# EAGLE design LPC_AP2_3.43 (EAGLE 5.00)
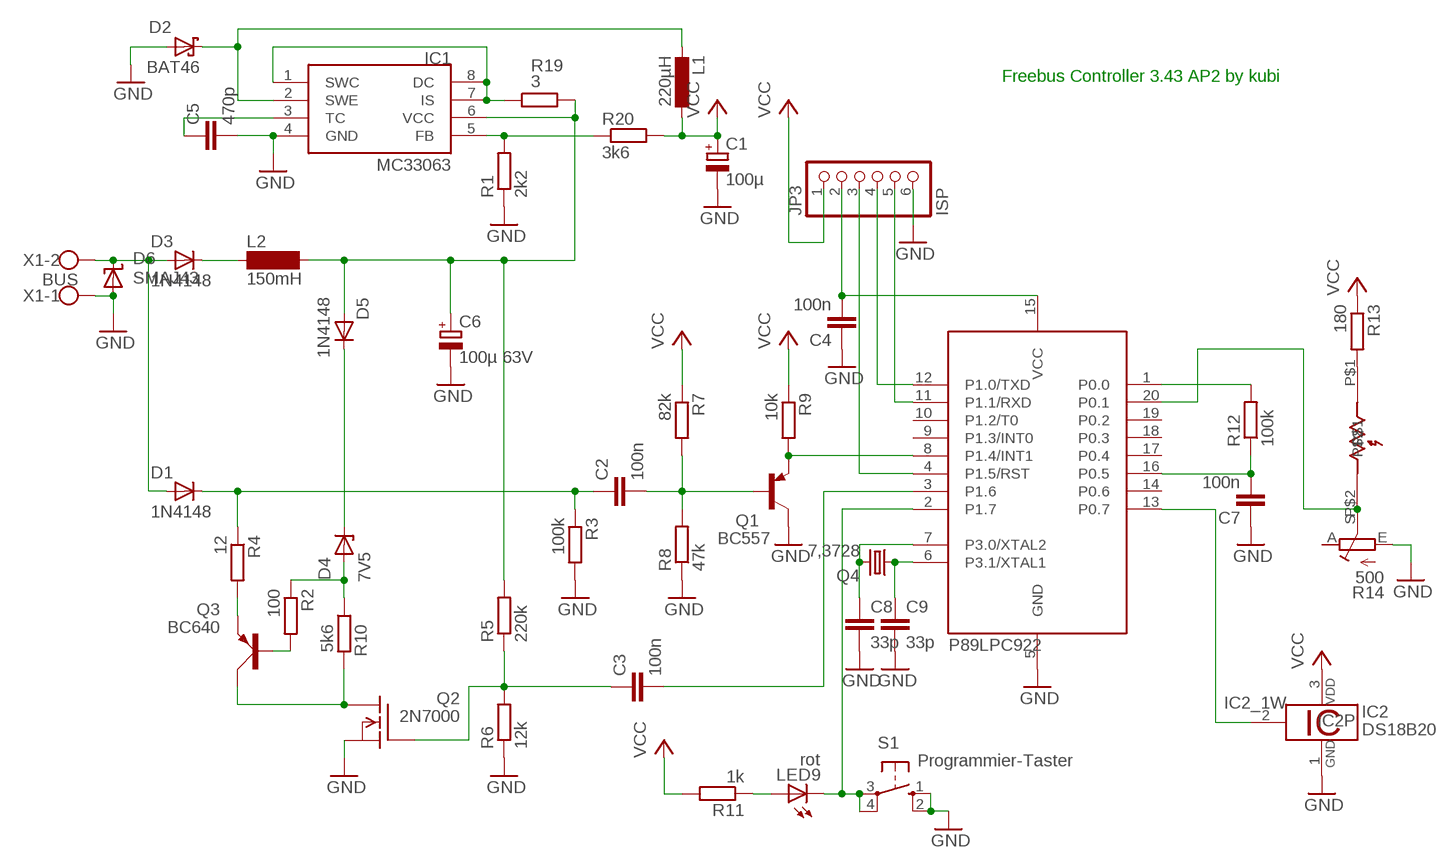
[diagram p0: schematic, sheet 1]

## Parts
C1  100µ  CPOL-EUE5-8.5  [E5-8,5]
C2  100n  C-EU050-024X044  [C050-024X044]
C3  100n  C-EU050-024X044  [C050-024X044]
C4  100n  C-EU050-024X044  [C050-024X044]
C5  470p  C-EU025-024X044  [C025-024X044]
C6  100µ 63V  CPOL-EUE5-8.5  [E5-8,5]
C7  100n  C-EU050-024X044  [C050-024X044]
C8  33p  C-EU025-024X044  [C025-024X044]
C9  33p  C-EU025-024X044  [C025-024X044]
D1  1N4148  DO35-LIEGEND  [DO35-L@1]
D2  BAT46  DO35S-STEHEND  [DO35S-S]
D3  1N4148  DO35-L  [DO35-L]
D4  7V5  DO35Z-L  [DO35Z-L]
D5  1N4148  DO35-S  [DO35-S]
D6  SMAJ43  SUPPRESSOR-SMBJ  [SMBJ]
IC1  MC33063  MC34063AP  [DIL08]
IC2  DS18B20  [TO92-]
JP3  ISP  PINHD-1X6  [1X06]
L1  220µH  L-EU2200-12.7  [2200-12.7]
L2  150mH  SD12K100  [SD12K100]
LED9  rot  LED3MM  [LED3MM]
Q1  BC557  [TO92]
Q2  2N7000  VN2222KM  [TO237]
Q3  BC640  [SOT54D]
Q4  7,3728  CRYSTALHC49S  [HC49/S]
R1  2k2  R-EU_0207/2V  [0207/2V]
R2  100  R-EU_0207/2V  [0207/2V]
R3  100k  R-EU_0207/2V  [0207/2V]
R4  12  R-EU_0207/2V  [0207/2V]
R5  220k  R-EU_0207/2V  [0207/2V]
R6  12k  R-EU_0207/2V  [0207/2V]
R7  82k  R-EU_0207/2V  [0207/2V]
R8  47k  R-EU_0207/2V  [0207/2V]
R9  10k  R-EU_0207/2V  [0207/2V]
R10  5k6  R-EU_0207/2V  [0207/2V]
R11  1k  R-EU_0207/2V  [0207/2V]
R12  100k  R-EU_0207/2V  [0207/2V]
R13  180  R-EU_0207/2V  [0207/2V]
R14  500  R-TRIMM-PT6L  [PT6L]
R19  3  R-EU_0207/2V  [0207/2V]
R20  3k6  R-EU_0207/10  [0207/10]
S1  Programmier-Taster  10-XX  [B3F-10XX]
U1  89LPC922  [DIL20]
U$2  LDR07  [LDR07]
X1  BUS  W237-02P  [W237-132]

## Nets
GND: C1.- C4.1 C5.2 C6.- C7.1 C8.2 C9.2 D2.A D6.A IC1.4(GND) IC2.1 JP3.6 Q1.3(C) Q2.3(S) R1.1 R3.2 R6.1 R8.1 R14.E S1.1(S) S1.2(S1) U1.5(GND) X1.1
N$1: Q1.1(E) R9.2 U1.8(P1.4/INT1)
N$2: C2.2 Q1.2(B) R7.2 R8.2
N$3: IC1.5(FB) R1.2 R20.1
N$4: IC1.1(SWC) IC1.7(IS) IC1.8(DC) R19.1
N$5: C3.2 U1.3(P1.6)
N$6: Q2.1(D) Q3.C R10.2
N$7: C6.+ D5.A IC1.6(VCC) L2.2 R5.2 R19.2
N$8: D3.K L2.1
N$9: C2.1 D1.P$2(B) R3.1 R4.1
N$10: D2.K IC1.2(SWE) L1.2
N$11: D4.A R2.1 R10.1
N$12: Q3.E R4.2
N$13: C5.1 IC1.3(TC)
N$14: Q3.B R2.2
N$15: D1.P$1(A) D3.A D6.C X1.2
N$16: R13.2 U$2.P$1
N$17: LED9.K(C) S1.3(P) S1.4(P1) U1.2(P1.7)
N$18: R14.S U1.20(P0.1) U$2.P$2
N$19: IC2.2 U1.13(P0.7)
N$20: C8.1 Q4.2 U1.7(P3.0/XTAL2)
N$21: C9.1 Q4.1 U1.6(P3.1/XTAL1)
N$29: JP3.4 U1.12(P1.0/TXD)
N$30: JP3.5 U1.11(P1.1/RXD)
N$31: JP3.3 U1.4(P1.5/RST)
N$32: C4.2 JP3.2 U1.15(VCC)
N$34: C3.1 Q2.2(G) R5.1 R6.2
N$40: D4.K D5.K
N$41: LED9.A R11.1
P0.0: R12.2 U1.1(P0.0)
P0.5: C7.2 R12.1 U1.16(P0.5)
VCC: C1.+ IC2.3 JP3.1 L1.1 R7.1 R9.1 R11.2 R13.1 R20.2
Unconnected: R14.A U1.9(P1.3/INT0) U1.10(P1.2/T0) U1.14(P0.6) U1.17(P0.4) U1.18(P0.3) U1.19(P0.2)

## Notes on the sheet
- Freebus Controller 3.43 AP2 by kubi
- P89LPC922

## Library data of the parts
C1 C6 = rcl:CPOL-EU: POLARIZED CAPACITOR, European symbol
C2-C5 C7-C9 = rcl:C-EU: CAPACITOR, European symbol
D1 = kubi:DO35-LIEGEND
D2 = kubi:DO35S-STEHEND
D3 D5 = kubi:DO35
D4 = kubi:DO35Z
D6 = diode:SUPPRESSOR-: Suppressor diode
IC1 = mc34063:MC34063
IC2 = 1wire:DS18B20: Programmable Resolution Digital Thermometer This chip provides a onewire thermosensor with approx. 0.5°C accuracy. A programmable over/undertemperure alarm is available. The precision can be set from 9..12 bits. Notes: Vdd must be applied for accurate measurements at low temperatures, as the parasite power circuit otherwise heats the sensor. If parasite power is used, Vdd has to be connected to GND. The DS1822 is a low-cost thermometer chip, the DS18S20 is similar to the DS18B20, but with 9 Bit precision only. Author: Jan Kandziora <jjj@gmx.de>
JP3 = pinhead:PINHD-1X6: PIN HEADER
L1 = rcl:L-EU: INDUCTOR, European symbol
L2 = inductor-neosid:SD12: INDUCTOR nominal inductance
LED9 = led:LED: LED OSRAM: - CHIPLED LG R971, LG N971, LY N971, LG Q971, LY Q971, LO R971, LY R971 LH N974, LH R974 LS Q976, LO Q976, LY Q976 LO Q996 - Hyper CHIPLED LW Q18S LB Q993, LB Q99A, LB R99A - SideLED LS A670, LO A670, LY A670, LG A670, LP A670 LB A673, LV A673, LT A673, LW A673 LH A674 LY A675 LS A676, LA A676, LO A676, LY A676, LW A676 LS A679, LY A679, LG A679 - Hyper Micro SIDELED® LS Y876, LA Y876, LO Y876, LY Y876 LT Y87S - SmartLED LW L88C, LW L88S LB L89C, LB L89S, LG L890 LS L89K, LO L89K, LY L89K LS L896, LA L896, LO L896, LY L896 - TOPLED LS T670, LO T670, LY T670, LG T670, LP T670 LSG T670, LSP T670, LSY T670, LOP T670, LYG T670 LG T671, LOG T671, LSG T671 LB T673, LV T673, LT T673, LW T673 LH T674 LS T676, LA T676, LO T676, LY T676, LB T676, LH T676, LSB T676, LW T676 LB T67C, LV T67C, LT T67C, LS T67K, LO T67K, LY T67K, LW E67C LS E67B, LA E67B, LO E67B, LY E67B, LB E67C, LV E67C, LT E67C LW T67C LS T679, LY T679, LG T679 LS T770, LO T770, LY T770, LG T770, LP T770 LB T773, LV T773, LT T773, LW T773 LH T774 LS E675, LA E675, LY E675, LS T675 LS T776, LA T776, LO T776, LY T776, LB T776 LHGB T686 LT T68C, LB T68C - Hyper Mini TOPLED® LB M676 - Mini TOPLED Santana® LG M470 LS M47K, LO M47K, LY M47K Source: http://www.osram.convergy.de - LUMILED® LXK2-PW12-R00, LXK2-PW12-S00, LXK2-PW14-U00, LXK2-PW14-V00 LXK2-PM12-R00, LXK2-PM12-S00, LXK2-PM14-U00 LXK2-PE12-Q00, LXK2-PE12-R00, LXK2-PE12-S00, LXK2-PE14-T00, LXK2-PE14-U00 LXK2-PB12-K00, LXK2-PB12-L00, LXK2-PB12-M00, LXK2-PB14-N00, LXK2-PB14-P00, LXK2-PB14-Q00 LXK2-PR12-L00, LXK2-PR12-M00, LXK2-PR14-Q00, LXK2-PR14-R00 LXK2-PD12-Q00, LXK2-PD12-R00, LXK2-PD12-S00 LXK2-PH12-R00, LXK2-PH12-S00 LXK2-PL12-P00, LXK2-PL12-Q00, LXK2-PL12-R00 Source: www.luxeon.com
Q1 = transistor-pnp:BC557: PNP Transistor
Q2 = transistor-fet:VN2222KM: N-Channel Enhancement MOSFET (VMOS); 60V; 0,5A; 7,5Ohm
Q3 = transistor-small-signal:BC640: PNP TRANSISTOR
Q4 = crystal:CRYSTAL: CRYSTAL
R1-R13 R19 R20 = rcl:R-EU_: RESISTOR, European symbol
R14 = kubi:R-TRIMM
S1 = switch-omron:10-XX: OMRON SWITCH
U1 = micro-philips:89LPC922
U$2 = ldr:LDR07
X1 = con-wago-508:W237-02P: WAGO SREW CLAMP

## Board
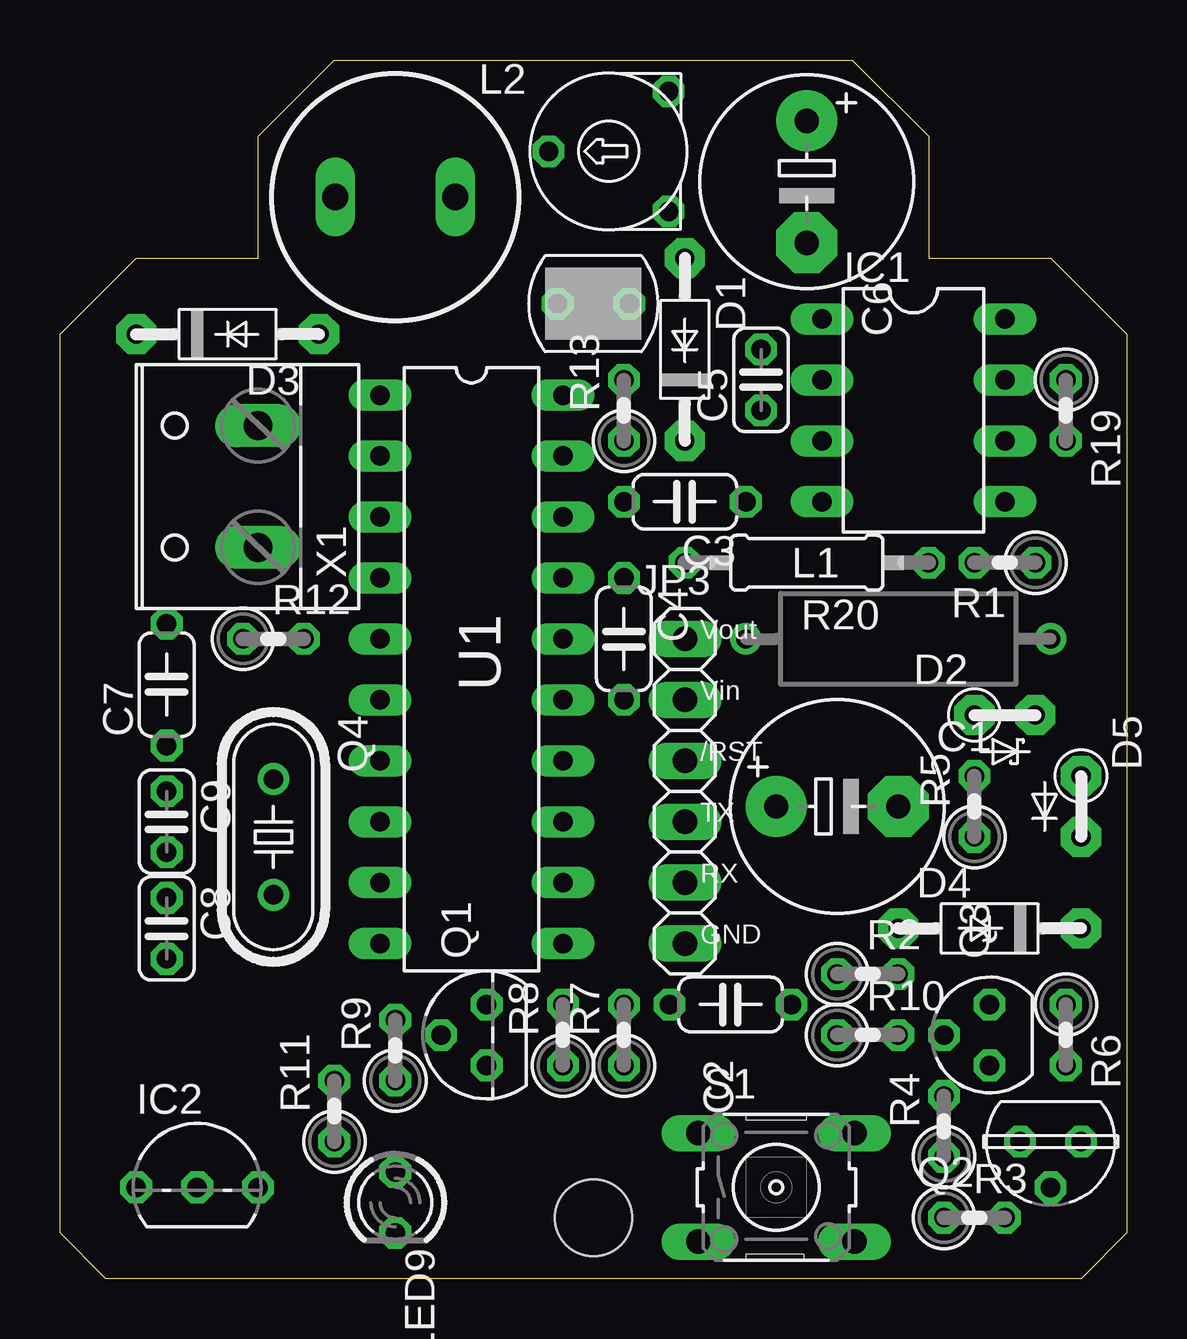
[diagram p1: board, top side]
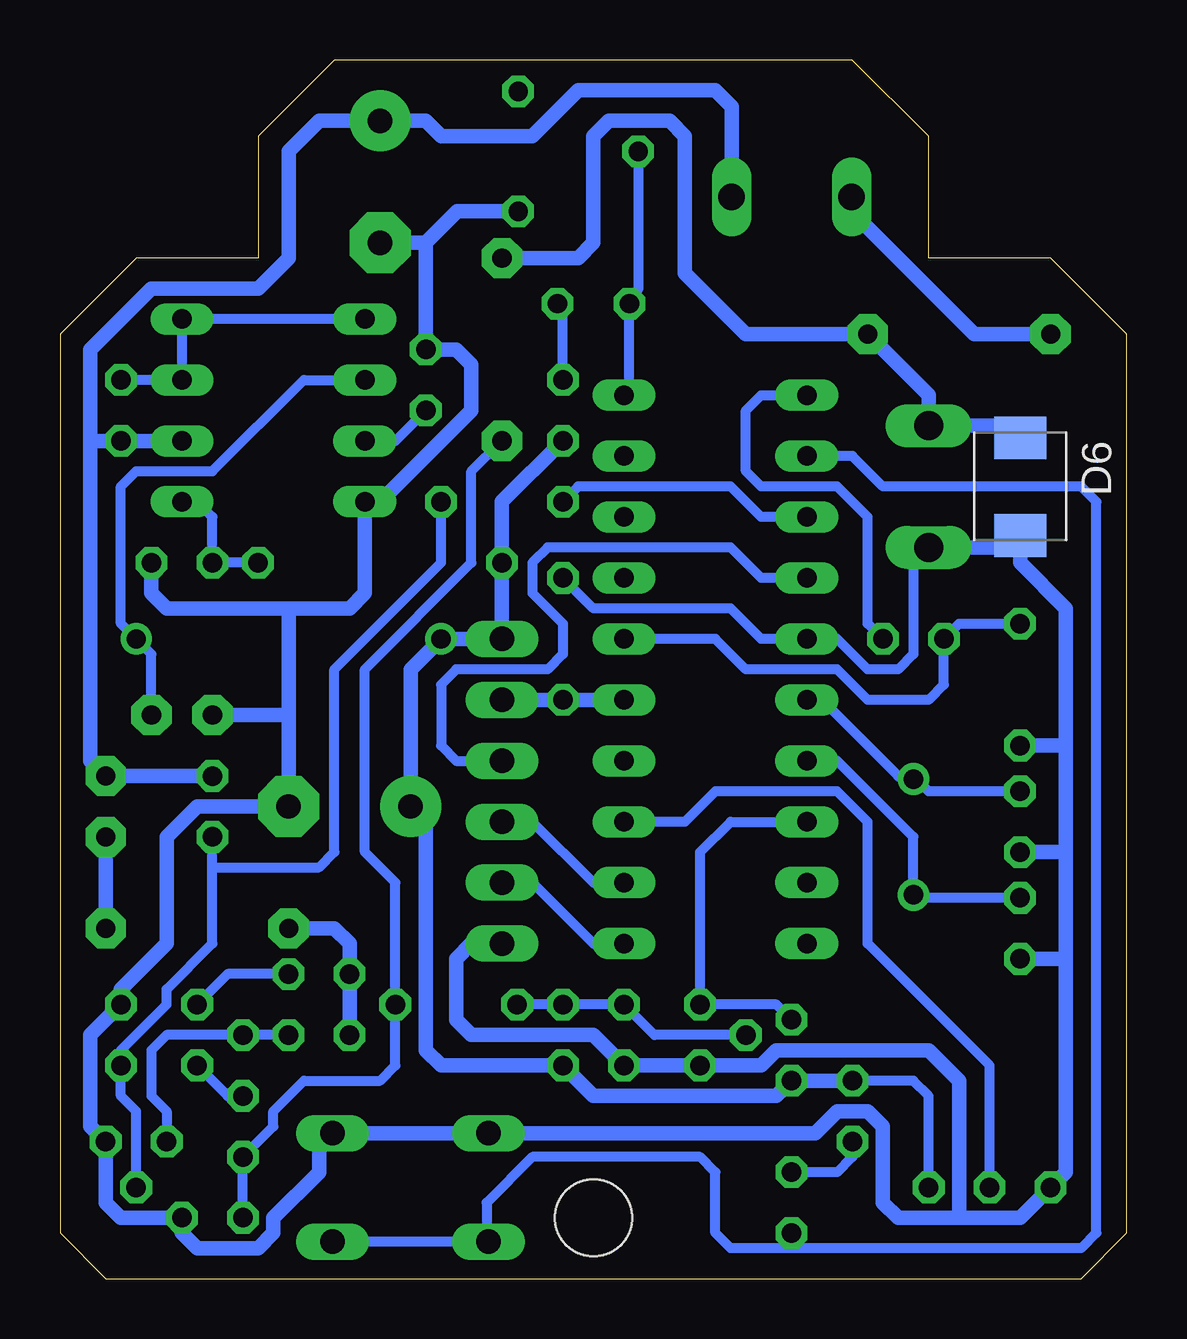
[diagram p2: board, bottom side, seen from below]

Size 44.45 x 50.8 mm. Coordinates in mm from the lower left corner, seen from the top.
Outline: 1.91,0 0,1.91 0,39.37 3.17,42.55 8.26,42.55 8.26,47.62 11.43,50.8 33.02,50.8 36.2,47.62 36.2,42.55 41.27,42.55 44.45,39.37 44.45,1.91 42.55,0 1.91,0
Copper layers (1*16): Top 0.035mm / dielectric 1.5mm / Bottom 0.035mm
Design rules "default *": minimum track width 10mil, minimum drill 24mil, track to track 12mil, track to pad 12mil, pad to pad 12mil, via to via 12mil, smd to smd 8mil, copper to edge 20mil, drill to drill 8mil, minimum pad ring 10mil, minimum via ring 8mil, stop-mask expansion 4mil, vias tented up to drill 0mil, thermal gap 10mil
Holes 3.2 mm at 22.23,2.54

### Footprints (pad centres in the part's own frame; a part is rotated, then mirrored left to right if it is on the bottom)
E5-8,5 = drill 1.016 pad 2.54 round: + -2.54,0 | drill 1.016 pad 2.54 octagon: - 2.54,0
C050-024X044 = drill 0.813 octagon: 1 -2.54,0; 2 2.54,0
C025-024X044 = drill 0.813 octagon: 1 -1.27,0; 2 1.27,0
DO35-L@1 = drill 0.8 pad 1.676 octagon: P$1 -3.81,0; P$2 3.81,0
DO35S-S = drill 0.8 pad 1.676 octagon: A -1.27,0; K 1.27,0
DO35-L = drill 0.8 pad 1.676 octagon: A -3.81,0; K 3.81,0
DO35Z-L = drill 0.8 pad 1.676 octagon: A -3.81,0; K 3.81,0
DO35-S = drill 0.8 pad 1.676 octagon: A -1.27,0; K 1.27,0
SMBJ = smd 1.78 x 2.16: A 2.04,0; C -2.03,0
DIL08 = drill 0.813 long: 1 -3.81,-3.81; 2 -1.27,-3.81; 3 1.27,-3.81; 4 3.81,-3.81; 5 3.81,3.81; 6 1.27,3.81; 7 -1.27,3.81; 8 -3.81,3.81
TO92- = drill 0.813 octagon: 1 -2.54,0; 2 0,0; 3 2.54,0
1X06 = drill 1.016 long: 1 -6.35,0; 2 -3.81,0; 3 -1.27,0; 4 1.27,0; 5 3.81,0; 6 6.35,0
2200-12.7 = drill 0.8 pad 1.27 round: 1 -6.35,0; 2 6.35,0
SD12K100 = drill 1.1 long: 1 -2.5,0; 2 2.5,0
LED3MM = drill 0.813 octagon: A -1.27,0; K 1.27,0
TO92 = drill 0.813 octagon: 1 1.27,0; 2 0,1.905; 3 -1.27,0
TO237 = drill 0.813 octagon: 1 1.27,0; 2 0,1.905; 3 -1.27,0
SOT54D = drill 0.813 octagon: B 1.27,0; C 0,1.905; E -1.27,0
HC49/S = drill 0.813 round: 1 -2.413,0; 2 2.413,0
0207/2V = drill 0.813 octagon: 1 -1.27,0; 2 1.27,0
PT6L = drill 0.8 octagon: A 2.5,2.5; E 2.5,-2.5; S -2.5,0
0207/10 = drill 0.813 octagon: 1 -5.08,0; 2 5.08,0
B3F-10XX = drill 1.016 long: 1 -3.251,2.261; 2 3.251,2.261; 3 -3.251,-2.261; 4 3.251,-2.261
DIL20 = drill 0.813 long: 1 -11.43,-3.81; 2 -8.89,-3.81; 3 -6.35,-3.81; 4 -3.81,-3.81; 5 -1.27,-3.81; 6 1.27,-3.81; 7 3.81,-3.81; 8 6.35,-3.81; 9 8.89,-3.81; 10 11.43,-3.81; 11 11.43,3.81; 12 8.89,3.81; 13 6.35,3.81; 14 3.81,3.81; 15 1.27,3.81; 16 -1.27,3.81; 17 -3.81,3.81; 18 -6.35,3.81; 19 -8.89,3.81; 20 -11.43,3.81
LDR07 = drill 0.8 octagon: P$1 -1.5,0; P$2 1.5,0
W237-132 = drill 1.194 long: 1 -2.54,-0.635; 2 2.54,-0.635

### Placement (x,y rotation side)
C1  32.38,19.68 0 top
C2  27.94,11.43 180 top
C3  26.04,32.38 180 top
C4  23.5,26.67 270 top
C5  29.21,37.47 90 top
C6  31.11,45.72 270 top
C7  4.45,24.77 90 top
C8  4.45,14.61 270 top
C9  4.45,19.05 270 top
D1  26.04,38.73 270 top
D2  39.37,23.5 0 top
D3  6.99,39.37 180 top
D4  38.73,14.61 0 top
D5  42.55,19.68 270 top
D6  4.45,33.02 270 bottom
IC1  35.56,36.2 270 top
IC2  5.71,3.81 0 top
JP3  26.04,20.32 270 top
L1  34.92,26.67 0 top
L2  13.97,45.09 0 top
LED9  13.97,3.17 270 top
Q1  17.78,10.16 90 top
Q2  41.27,5.71 180 top
Q3  38.73,10.16 90 top
Q4  8.89,18.41 270 top
R1  39.37,29.84 180 top
R2  33.66,12.7 0 top
R3  38.1,2.54 0 top
R4  36.83,6.35 90 top
R5  38.1,19.68 90 top
R6  41.91,10.16 270 top
R7  23.5,10.16 90 top
R8  20.95,10.16 90 top
R9  13.97,9.53 90 top
R10  33.66,10.16 0 top
R11  11.43,6.99 90 top
R12  8.89,26.67 0 top
R13  23.5,36.2 90 top
R14  22.86,46.99 0 top
R19  41.91,36.2 270 top
R20  31.11,29.84 180 top
S1  29.84,3.81 0 top
U1  17.14,25.4 270 top
U$2  22.23,40.64 180 top
X1  7.62,33.02 90 top

### Tracks (layer width: path | path; a pad name or v marks a point on that pad's centre or on a via)
GND
  Bottom 0.406: C4.1 22.23,27.94 16.51,27.94 15.24,26.67 U1.5 12.06,26.67 10.79,25.4 9.53,25.4 8.89,26.04 8.89,29.84 X1.1
  Bottom 0.61: S1.1 12.98,6.07 12.06,6.99 10.79,6.99 10.16,6.35 10.16,3.17 9.53,2.54 6.99,2.54 | JP3.6 27.3,13.97 27.94,13.34 27.94,10.79 27.3,10.16 22.23,10.16 R8.1 Q1.3 15.24,8.89 14.61,9.53 8.26,9.53 6.99,8.26 6.99,2.54 | S1.1 23.14,6.07 | S1.1 26.67,6.07 | 26.67,6.07 S1.2 33.1,6.27 | 2.54,13.34 2.54,17.78 | 34.92,23.5 C1.- 38.73,19.68 40.01,18.41 40.01,13.97 41.91,12.06 R6.1 43.18,10.16 43.18,6.35 Q2.3 42.55,3.17 41.91,2.54 R3.2 39.37,1.91 38.73,1.27 36.2,1.27 35.56,1.91 35.56,2.54 33.66,4.45 33.66,5.71 33.1,6.27 | 29.21,43.18 C5.2 27.94,38.73 27.3,38.1 27.3,36.2 31.11,32.38 IC1.4 31.75,28.57 32.38,27.94 34.92,27.94 | 29.21,43.18 C6.- | 26.67,6.07 26.67,6.35 26.59,6.27 S1.1 | 34.92,23.5 D2.A | 2.54,17.78 C9.2 | 2.54,13.34 C8.2 | 6.99,2.54 4.45,2.54 IC2.1 2.54,4.45 2.54,13.34 | 33.1,6.27 33.02,6.35 | R1.1 40.64,28.57 40.01,27.94 34.92,27.94 | 34.92,23.5 34.92,27.94 | R14.E 27.9,44.49 29.21,43.18 | 4.45,30.48 D6.A | 4.45,30.48 X1.1 | 4.45,30.48 4.45,29.84 2.54,27.94 2.54,22.23 | 2.54,17.78 2.54,22.23 | 2.54,22.23 C7.1
N$1
  Bottom 0.406: U1.8 16.51,19.05 17.78,17.78 Q1.1 14.61,11.43 R9.2
N$2
  Bottom 0.406: Q1.2 19.68,10.16 R8.2 R7.2 C2.2
N$3
  Bottom 0.406: R20.1 R1.2 38.1,31.75 38.73,32.38 IC1.5
N$4
  Bottom 0.406: IC1.1 IC1.8 IC1.7 R19.1
N$5
  Bottom 0.406: U1.3 15.24,31.75 16.51,33.02 22.86,33.02 C3.2
N$6
  Bottom 0.406: Q2.1 40.01,6.99 40.64,7.62 40.64,9.53 40.01,10.16 Q3.C R10.2
N$7
  Bottom 0.61: R5.2 D5.A 43.18,21.59 43.18,34.92 | L2.2 16.47,48.85 17.14,49.53 22.86,49.53 24.77,47.62 28.57,47.62 29.21,48.26 C6.+ 33.66,48.26 34.92,46.99 34.92,42.55 36.2,41.27 40.64,41.27 43.18,38.73 43.18,34.92 | IC1.6 R19.2 43.18,34.92
N$8
  Bottom 0.406: 11.43,45.09 L2.1
  Bottom 0.61: 11.43,45.09 11.43,44.45 6.35,39.37 D3.K
N$9
  Bottom 0.406: D1.P$2 27.3,33.66 27.3,29.84 31.75,25.4 31.75,17.78 30.48,16.51 C2.1 30.48,8.89 31.11,8.26 34.29,8.26 35.56,6.99 35.56,6.35 R4.1 R3.1
N$10
  Bottom 0.406: IC1.2 34.29,37.47 38.1,33.66 41.27,33.66 41.91,33.02 41.91,27.3 L1.2 40.64,26.04 D2.K
N$11
  Bottom 0.61: R10.1 R2.1 32.38,13.97 33.02,14.61 D4.A
N$12
  Bottom 0.406: R4.2 37.47,7.62 Q3.E
N$13
  Bottom 0.406: C5.1 30.48,34.92 IC1.3
N$14
  Bottom 0.406: R2.2 37.47,12.7 Q3.B
N$15
  Bottom 0.61: D1.P$1 22.86,42.55 22.23,43.18 22.23,47.62 21.59,48.26 19.05,48.26 18.41,47.62 18.41,41.91 15.88,39.37 D3.A 8.26,36.83 X1.2 4.45,35.56 D6.C 4.45,34.92
N$16
  Bottom 0.406: U$2.P$1 23.5,40.64 R13.2
N$17
  Bottom 0.406: 13.97,1.27 1.91,1.27 1.27,1.91 1.27,32.38 1.91,33.02 10.16,33.02 11.43,34.29 U1.2 | 13.97,1.27 LED9.K | 13.97,1.27 16.51,1.27 17.14,1.91 17.14,4.45 17.78,5.08 24.77,5.08 26.67,3.17 26.67,1.27 | 26.67,1.27 26.59,1.35 S1.3 | S1.4 26.95,1.55 26.67,1.27
N$18
  Bottom 0.406: U1.20 20.73,37.06 U$2.P$2 20.95,40.64 20.36,41.23 R14.S
N$19
  Bottom 0.406: IC2.2 5.71,8.89 10.79,13.97 10.79,19.05 12.06,20.32 17.14,20.32 18.41,19.05 U1.13
N$20
  Bottom 0.406: C8.1 8.89,15.88 Q4.2 8.89,18.41 12.06,21.59 U1.7
N$21
  Bottom 0.406: U1.6 12.7,24.13 9.53,20.95 8.89,20.95 | 8.89,20.95 Q4.1 | C9.1 8.26,20.32 8.89,20.95
N$29
  Bottom 0.406: U1.12 22.23,16.51 24.77,19.05 JP3.4
N$30
  Bottom 0.406: U1.11 22.23,13.97 24.77,16.51 JP3.5
N$31
  Bottom 0.406: U1.4 15.24,29.21 16.51,30.48 24.13,30.48 24.77,29.84 24.77,28.57 23.5,27.3 23.5,26.04 24.13,25.4 27.94,25.4 28.57,24.77 28.57,22.23 27.94,21.59 JP3.3
N$32
  Bottom 0.61: U1.15 C4.2 JP3.2
N$34
  Bottom 0.406: C3.1 28.57,29.84 33.02,25.4 33.02,17.78 33.66,17.14 38.1,17.14 | 38.1,17.14 38.1,13.97 40.01,12.06 40.01,11.43 41.91,9.53 R6.2 41.91,7.62 41.27,6.99 Q2.2 | 38.1,17.14 R5.1
N$40
  Bottom 0.61: D4.K D5.K
N$41
  Bottom 0.406: R11.1 11.43,5.08 12.06,4.45 LED9.A
P0.0
  Bottom 0.406: R12.2 10.79,27.3 10.79,31.75 12.06,33.02 15.24,33.02 15.88,33.66 15.88,36.2 15.24,36.83 U1.1
P0.5
  Bottom 0.406: U1.16 17.14,26.67 15.88,25.4 12.06,25.4 10.79,24.13 8.26,24.13 7.62,24.77 R12.1 6.99,27.3 C7.2
VCC
  Bottom 0.406: IC2.3 8.26,7.62 8.89,8.26 R11.2
  Bottom 0.61: R11.2 R9.1 14.61,7.62 22.23,7.62 R7.1 28.57,8.89 29.21,9.53 29.21,19.05 C1.+ 29.84,25.4 L1.1 JP3.1 R20.2 26.04,32.38 R13.1

### Text on the board
tPlace: Vout | Vin | /RST | TX | RX | GND